# EAGLE design Onion-Omega2-BLE-Pro-Expansion (EAGLE 7.7.0)
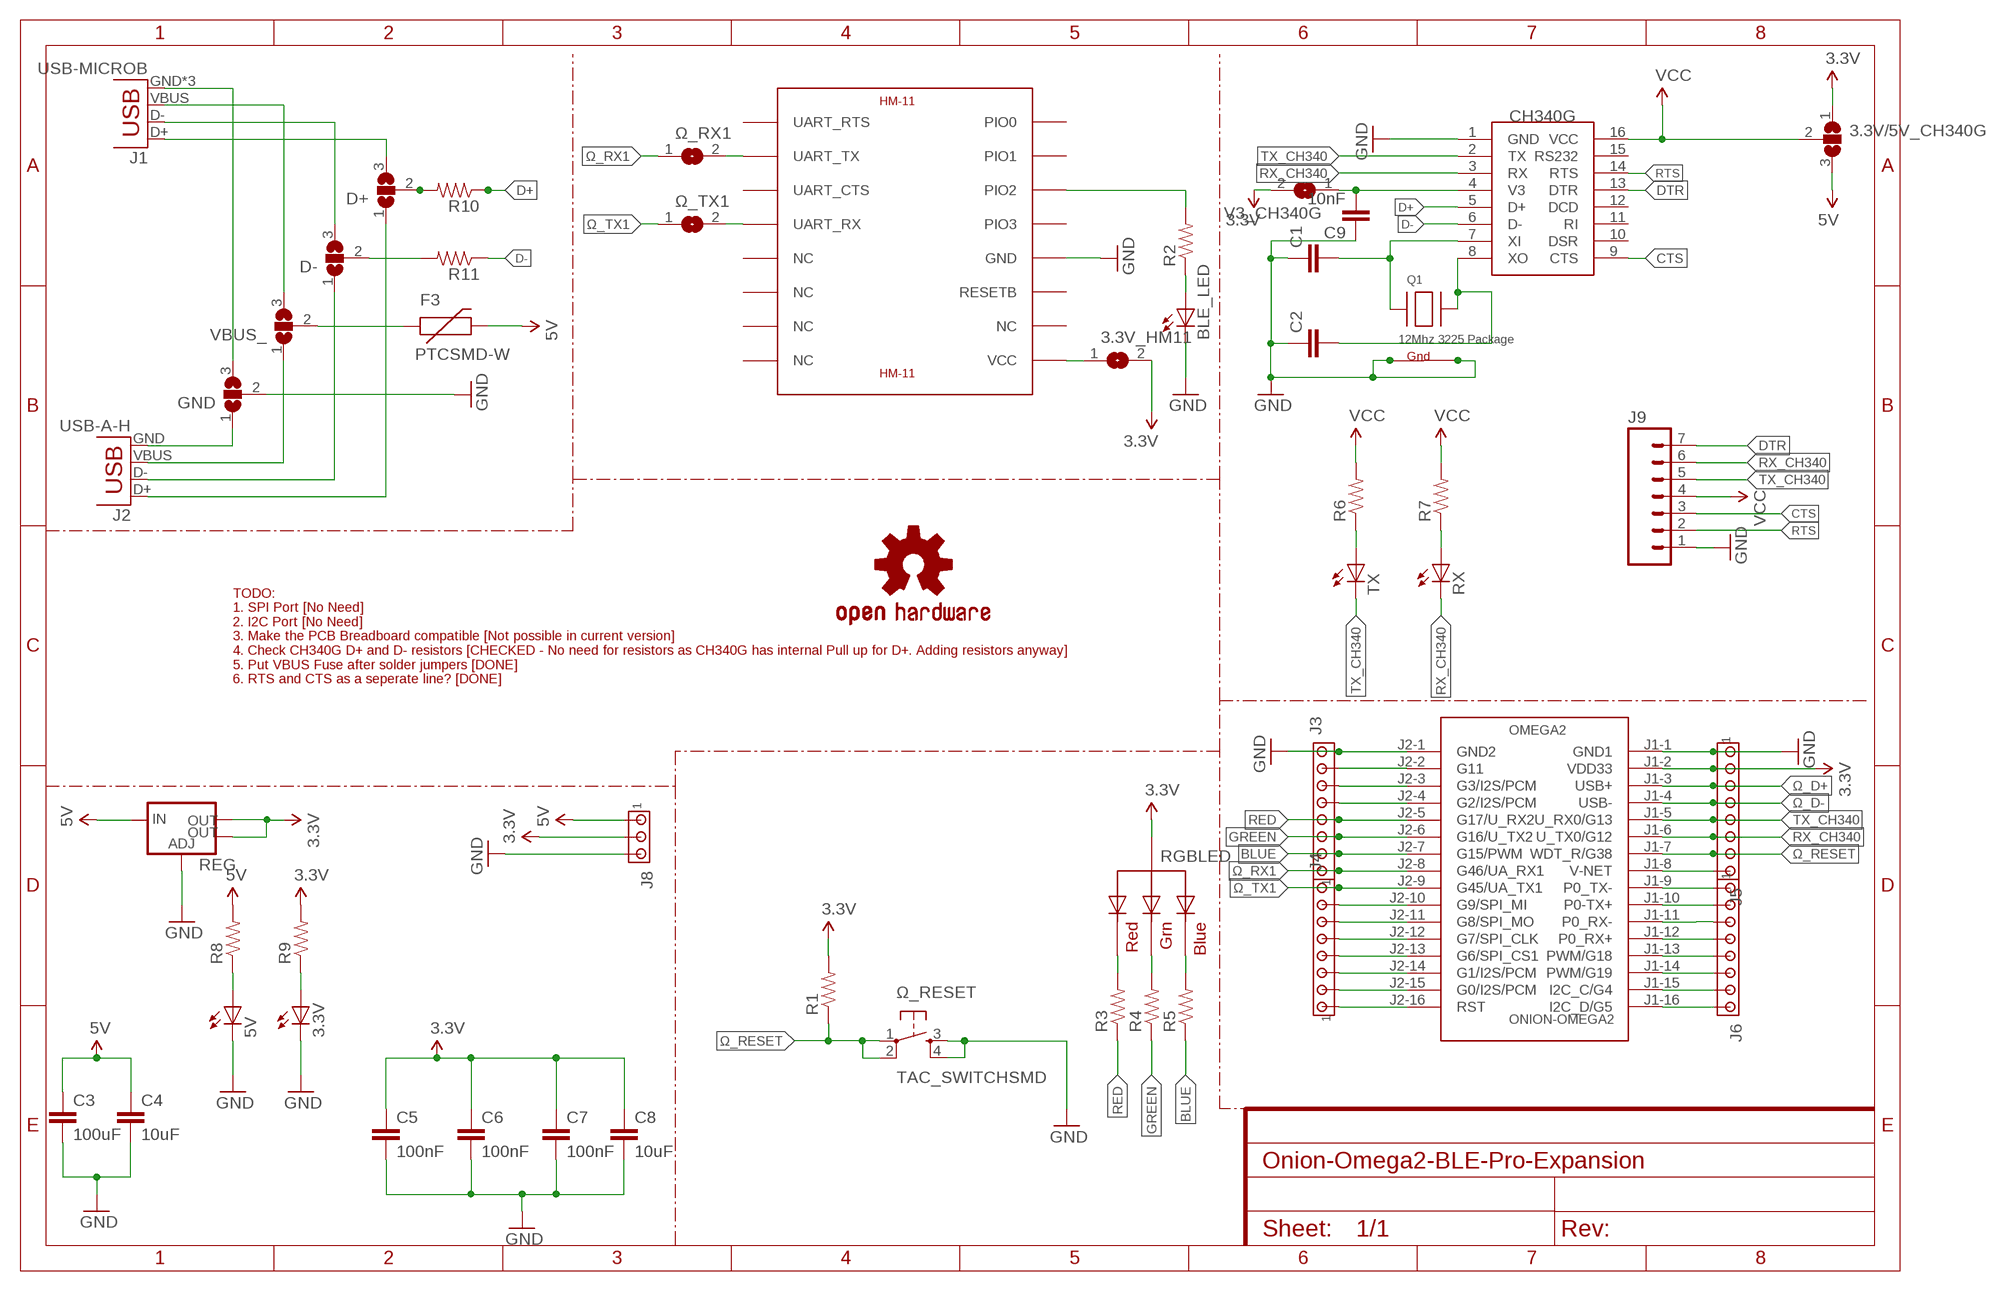
[diagram p0: schematic, sheet 1]

## Parts
3.3V  LEDCHIPLED_1206  [CHIPLED_1206]
3.3V/5V_CH340G  SJ2W  [SJ_2]
3.3V_HM11  SJ  [SJ]
5V  LEDCHIPLED_1206  [CHIPLED_1206]
BLE_LED  LEDCHIPLED_1206  [CHIPLED_1206]
C1  CAP1206  [1206]
C2  CAP1206  [1206]
C3  100uF  CAP1206  [1206]
C4  10uF  CAP1206  [1206]
C5  100nF  CAP1206  [1206]
C6  100nF  CAP1206  [1206]
C7  100nF  CAP1206  [1206]
C8  10uF  CAP1206  [1206]
C9  10nF  CAP1206  [1206]
D+  SJ2W  [SJ_2]
D-  SJ2W  [SJ_2]
F3  PTCSMD-W  [PTC-1206-WIDE]
GND  SJ2W  [SJ_2]
J1  USB-MICROB  [USB-MICROB]
J2  USB-A-H  [USB-A-H]
J3  MTA08-100  [10X08MTA]
J4  MTA08-100  [10X08MTA]
J5  MTA08-100  [10X08MTA]
J6  MTA08-100  [10X08MTA]
J8  MTA03-100  [10X03MTA]
J9  M07SMD  [1X07-SMD-FEMALE-V2]
LOGO1  OSHW-LOGOMINI  [OSHW-LOGO-MINI]
OMEGA2  ONION-OMEGA2  [ONION-2MM-2X16]
Q1  12Mhz 3225 Package  XTAL-4-3225  [NX3225]
R1  RESISTOR1206  [1206]
R2  RESISTOR1206  [1206]
R3  RESISTOR1206  [1206]
R4  RESISTOR1206  [1206]
R5  RESISTOR1206  [1206]
R6  RESISTOR1206  [1206]
R7  RESISTOR1206  [1206]
R8  RESISTOR1206  [1206]
R9  RESISTOR1206  [1206]
R10  RESISTOR0805-RES  [0805]
R11  RESISTOR0805-RES  [0805]
REG  V_REG_LM1117SOT223  [SOT223]
RGBLED  RGBLED_CA-PIRANHA  [PIRANHA5MM]
RX  LEDCHIPLED_1206  [CHIPLED_1206]
TX  LEDCHIPLED_1206  [CHIPLED_1206]
U$1  CH340G  [SOIC16]
U$2  HM-11  [HM-11]
V3_CH340G  SJ  [SJ]
VBUS_  SJ2W  [SJ_2]
Ω_RESET  TAC_SWITCHSMD  [TACTILE-SWITCH-SMD]
Ω_RX1  SJ  [SJ]
Ω_TX1  SJ  [SJ]

## Nets
3.3V: 3.3V/5V_CH340G.1 3.3V_HM11.2 C5.1 C6.1 C7.1 C8.1 J5.2 J8.2 OMEGA2.J1-2(VDD33) R1.2 R9.2 REG.2(OUT) REG.4(OUT) RGBLED.4(VCC) V3_CH340G.2
5V: 3.3V/5V_CH340G.3 C3.1 C4.1 F3.2 J8.1 R8.2 REG.3(IN)
BLUE: J3.2 OMEGA2.J2-7(G15/PWM) R5.1
CTS: J9.3 U$1.9(CTS)
D+: R10.1 U$1.5(D+)
D-: R11.1 U$1.6(D-)
DTR: J9.7 U$1.13(DTR)
GND: 3.3V.C 5V.C BLE_LED.C C1.1 C2.1 C3.2 C4.2 C5.2 C6.2 C7.2 C8.2 C9.1 GND.2 J3.8 J5.1 J8.3 J9.1 OMEGA2.J1-1(GND1) OMEGA2.J2-1(GND2) Q1.2(G2) Q1.4(G1) REG.1(ADJ) U$1.1(GND) U$2.GND Ω_RESET.3 Ω_RESET.4
GREEN: J3.3 OMEGA2.J2-6(G16/U_TX2) R4.1
N$1: C1.2 Q1.1(X1) U$1.7(XI)
N$2: C2.2 Q1.3(X2) U$1.8(XO)
N$3: R2.2 U$2.PIO2
N$4: BLE_LED.A R2.1
N$5: U$2.UART_TX Ω_RX1.2
N$6: J3.7 OMEGA2.J2-2(G11)
N$7: J3.6 OMEGA2.J2-3(G3/I2S/PCM)
N$8: J3.5 OMEGA2.J2-4(G2/I2S/PCM)
N$9: C9.2 U$1.4(V3) V3_CH340G.1
N$11: R6.1 TX.A
N$12: U$2.UART_RX Ω_TX1.2
N$13: 3.3V_HM11.1 U$2.VCC
N$14: J4.7 OMEGA2.J2-10(G9/SPI_MI)
N$15: J4.6 OMEGA2.J2-11(G8/SPI_MO)
N$16: J4.5 OMEGA2.J2-12(G7/SPI_CLK)
N$17: J4.4 OMEGA2.J2-13(G6/SPI_CS1)
N$18: J4.3 OMEGA2.J2-14(G1/I2S/PCM)
N$19: J4.2 OMEGA2.J2-15(G0/I2S/PCM)
N$20: J4.1 OMEGA2.J2-16(RST)
N$21: R3.2 RGBLED.2(RED)
N$22: R4.2 RGBLED.3(GREEN)
N$23: R5.2 RGBLED.1(BLUE)
N$24: R7.1 RX.A
N$25: 5V.A R8.1
N$26: 3.3V.A R9.1
N$27: F3.1 VBUS_.2
N$28: J5.8 OMEGA2.J1-8(V-NET)
N$29: J6.1 OMEGA2.J1-9(P0_TX-)
N$30: J6.2 OMEGA2.J1-10(P0-TX+)
N$31: J6.3 OMEGA2.J1-11(P0_RX-)
N$32: J6.4 OMEGA2.J1-12(P0_RX+)
N$33: J6.5 OMEGA2.J1-13(PWM/G18)
N$34: J6.6 OMEGA2.J1-14(PWM/G19)
N$35: J6.7 OMEGA2.J1-15(I2C_C/G4)
N$36: J6.8 OMEGA2.J1-16(I2C_D/G5)
N$37: J2.VBUS VBUS_.1
N$38: D+.2 R10.2
N$39: GND.1 J2.GND
N$40: GND.3 J1.GND J1.MT1(GND) J1.MT2(GND)
N$41: J1.VBUS VBUS_.3
N$42: D-.3 J1.D-
N$43: D+.3 J1.D+
N$44: D-.2 R11.2
N$45: D-.1 J2.D-
N$46: D+.1 J2.D+
RED: J3.4 OMEGA2.J2-5(G17/U_RX2) R3.1
RTS: J9.2 U$1.14(RTS)
RX_CH340: J5.6 J9.6 OMEGA2.J1-6(U_TX0/G12) RX.C U$1.3(RX)
TX_CH340: J5.5 J9.5 OMEGA2.J1-5(U_RX0/G13) TX.C U$1.2(TX)
VCC: 3.3V/5V_CH340G.2 J9.4 R6.2 R7.2 U$1.16(VCC)
Ω_D+: J5.3 OMEGA2.J1-3(USB+)
Ω_D-: J5.4 OMEGA2.J1-4(USB-)
Ω_RESET: J5.7 OMEGA2.J1-7(WDT_R/G38) R1.1 Ω_RESET.1 Ω_RESET.2
Ω_RX1: J3.1 OMEGA2.J2-8(G46/UA_RX1) Ω_RX1.1
Ω_TX1: J4.8 OMEGA2.J2-9(G45/UA_TX1) Ω_TX1.1
Unconnected: U$1.10(DSR) U$1.11(RI) U$1.12(DCD) U$1.15(RS232) U$2.NC@5(NC) U$2.NC@6(NC) U$2.NC@7(NC) U$2.NC@8(NC) U$2.NC@10(NC) U$2.PIO0 U$2.PIO1 U$2.PIO3 U$2.RESETB U$2.UART_CTS U$2.UART_RTS

## Notes on the sheet
- TODO:
  1. SPI Port [No Need]
  2. I2C Port [No Need]
  3. Make the PCB Breadboard compatible [Not possible in current version]
  4. Check CH340G D+ and D- resistors [CHECKED - No need for resistors as CH340G has internal Pull up for D+. Adding resistors anyway]
  5. Put VBUS Fuse after solder jumpers [DONE]
  6. RTS and CTS as a seperate line? [DONE]

## Library data of the parts
3.3V 5V BLE_LED RX TX = adafruit:LED: LED OSRAM: - CHIPLED LG R971, LG N971, LY N971, LG Q971, LY Q971, LO R971, LY R971 LH N974, LH R974 LS Q976, LO Q976, LY Q976 LO Q996 - Hyper CHIPLED LW Q18S LB Q993, LB Q99A, LB R99A - SideLED LS A670, LO A670, LY A670, LG A670, LP A670 LB A673, LV A673, LT A673, LW A673 LH A674 LY A675 LS A676, LA A676, LO A676, LY A676, LW A676 LS A679, LY A679, LG A679 - Hyper Micro SIDELED® LS Y876, LA Y876, LO Y876, LY Y876 LT Y87S - SmartLED LW L88C, LW L88S LB L89C, LB L89S, LG L890 LS L89K, LO L89K, LY L89K LS L896, LA L896, LO L896, LY L896 - TOPLED LS T670, LO T670, LY T670, LG T670, LP T670 LSG T670, LSP T670, LSY T670, LOP T670, LYG T670 LG T671, LOG T671, LSG T671 LB T673, LV T673, LT T673, LW T673 LH T674 LS T676, LA T676, LO T676, LY T676, LB T676, LH T676, LSB T676, LW T676 LB T67C, LV T67C, LT T67C, LS T67K, LO T67K, LY T67K, LW E67C LS E67B, LA E67B, LO E67B, LY E67B, LB E67C, LV E67C, LT E67C LW T67C LS T679, LY T679, LG T679 LS T770, LO T770, LY T770, LG T770, LP T770 LB T773, LV T773, LT T773, LW T773 LH T774 LS E675, LA E675, LY E675, LS T675 LS T776, LA T776, LO T776, LY T776, LB T776 LHGB T686 LT T68C, LB T68C - Hyper Mini TOPLED® LB M676 - Mini TOPLED Santana® LG M470 LS M47K, LO M47K, LY M47K Source: http://www.osram.convergy.de/
3.3V/5V_CH340G D+ D- GND VBUS_ = jumper:SJ2W: SMD solder JUMPER
3.3V_HM11 V3_CH340G Ω_RX1 Ω_TX1 = jumper:SJ: SMD solder JUMPER
C1-C9 = SparkFun-Passives:CAP: Capacitor Standard 0603 ceramic capacitor, and 0.1" leaded capacitor.
F3 = SparkFun-PowerIC:PTC: Resettable Fuse PTC Resettable Fuse. Spark Fun Electronics SKU : COM-08357
J1 = SparkFun-Connectors:USB: USB Connectors USB-B-PTH is fully proven SKU : PRT-00139/CONN-08278 USB-miniB is fully proven SKU : PRT-00587 USB-A-PCB is untested. USB-A-H is throughly reviewed, but untested. Spark Fun Electronics SKU : PRT-00437 USB-B-SMT is throughly reviewed, but untested. Needs silkscreen touching up. USB-A-S has not been used/tested USB-MB-H has not been used/tested USB-MICROB has been used. CONN-09505; PROD_ID: CONN-09505
J2 = SparkFun-Connectors:USB: USB Connectors USB-B-PTH is fully proven SKU : PRT-00139/CONN-08278 USB-miniB is fully proven SKU : PRT-00587 USB-A-PCB is untested. USB-A-H is throughly reviewed, but untested. Spark Fun Electronics SKU : PRT-00437 USB-B-SMT is throughly reviewed, but untested. Needs silkscreen touching up. USB-A-S has not been used/tested USB-MB-H has not been used/tested USB-MICROB has been used. CONN-09505; PROD_ID: CONN-08367
J3-J6 = con-amp:MTA08-100: AMP connector
J8 = con-amp:MTA03-100: AMP connector
J9 = SparkFun-Connectors:M07: Header 7 Standard 7-pin 0.1" header. Use with straight break away headers (SKU : PRT-00116), right angle break away headers (PRT-00553), swiss pins (PRT-00743), machine pins (PRT-00117), and female headers (PRT-00115). NOTES ON THE VARIANTS LOCK and LOCK_LONGPADS... This footprint was designed to help hold the alignment of a through-hole component (i.e. 7-pin header) while soldering it into place. You may notice that each hole has been shifted either up or down by 0.005 of an inch from it's more standard position (which is usually a perfectly straight line). This slight alteration caused the pins (the squares in the middle) to touch the edges of the holes. Because they are alternating, it causes a "brace" to hold the header in place. 0.005 has proven to be the perfect amount of "off-center" position when using our standard breakaway headers. Although looks a little odd when you look at the bare footprint, once you have a header in there, the alteration is very hard to notice. Also, if you push a header all the way into place, it is covered up entirely on the bottom side. This idea of altering the position of holes to aid alignment will be further integrated into the Sparkfun Library for other footprints. It can help hold any component with 3 or more connection pins.
LOGO1 = SparkFun-Aesthetics:OSHW-LOGO: Open Source Hardware Logo This logo indicates the piece of hardware it is found on incorporates a OSHW license and/or adheres to the definition of open source hardware found here: http://freedomdefined.org/OSHW
OMEGA2 = Onion2:ONION-OMEGA2: Onion Omega
Q1 = adafruit:XTAL-4: Classic 4-pin 3.2 x 2.5mm crystal
R1-R11 = SparkFun-Passives:RESISTOR: Resistor Basic schematic elements and footprints for 0603, 1206, and PTH resistors.
REG = SparkFun-PowerIC:V_REG_LM1117: Voltage Regulator LM1117 Standard adjustable voltage regulator but in SMD form. Spark Fun Electronics SKU : COM-00595; PROD_ID: VREG-08170
RGBLED = adafruit:RGBLED_CA: RGB LED, common-anode 5MM Staggered pins 5mm Piranha package http://www.ladyada.net/library/pcb/eaglelibrary.html
U$1 = ch340g:CH340G
U$2 = hm-11:HM-11: JNHuaMao HM-11 Bluetooth 4.0 Transceiver based on TI CC2540/CC2541
Ω_RESET = SparkFun-Retired:TAC_SWITCH: Momentary Switch Button commonly used for reset or general input. Spark Fun Electronics SKU : COM-00097 SMT- SWCH-08247; PROD_ID: SWCH-08247

## Board
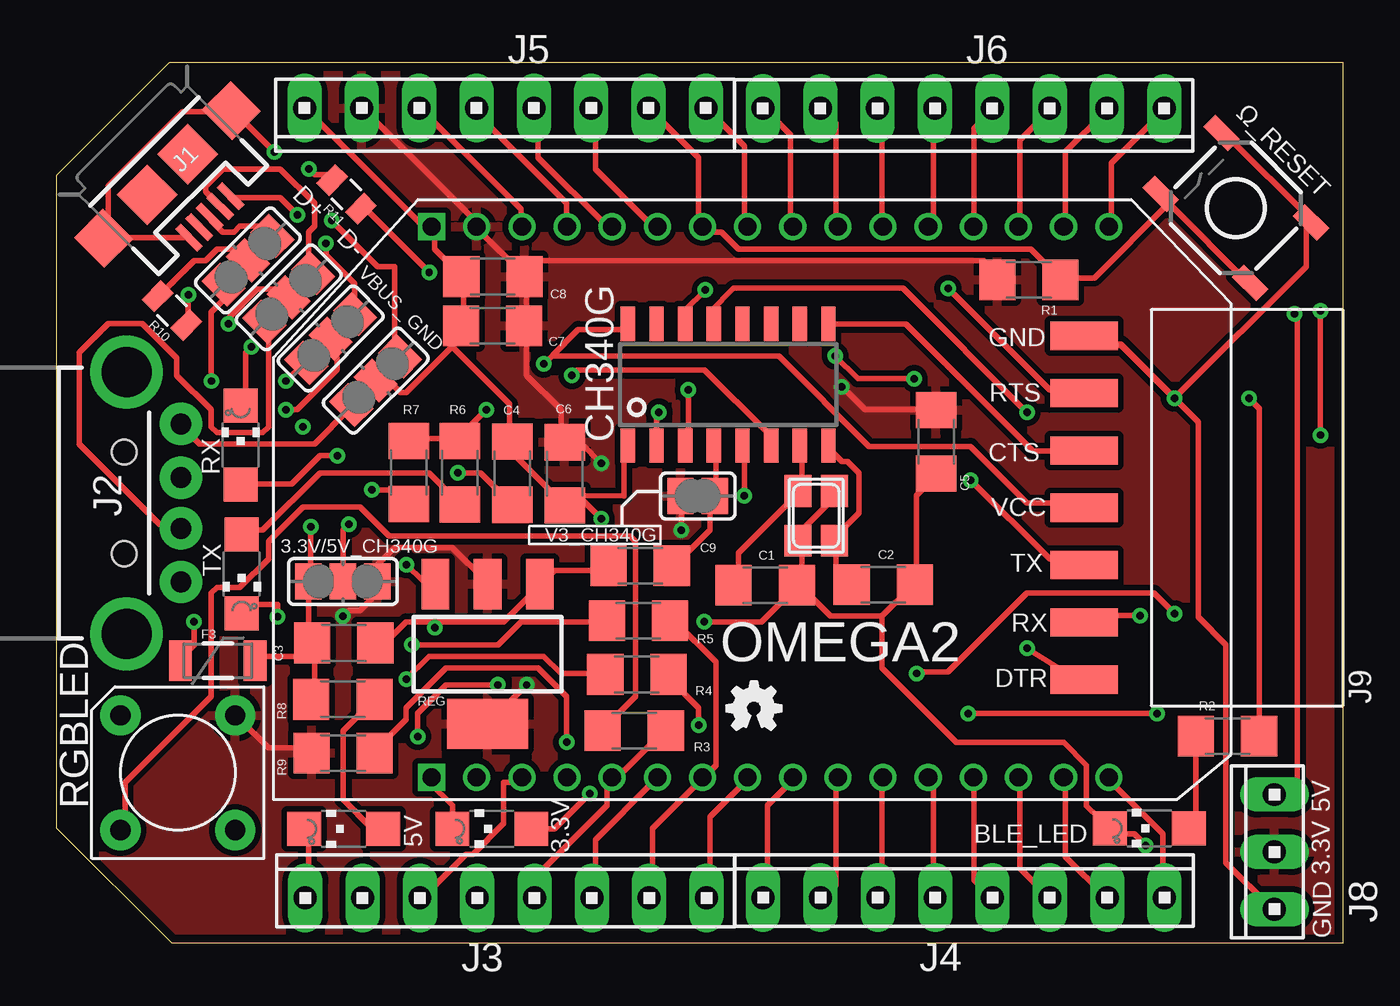
[diagram p1: board, top side]
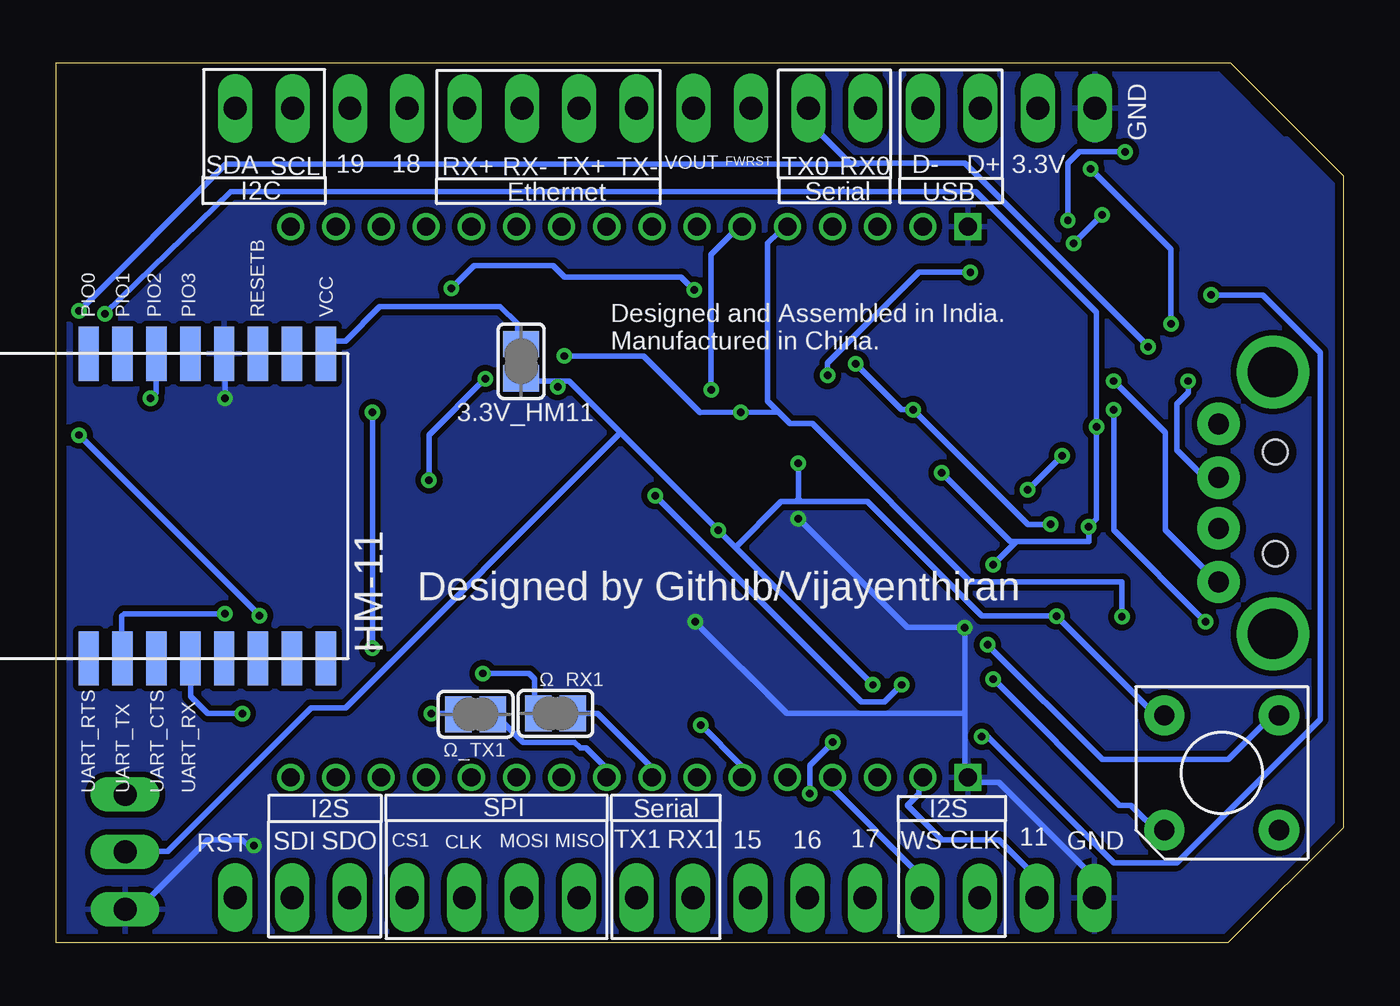
[diagram p2: board, bottom side, seen from below]

Size 57 x 39 mm. Coordinates in mm from the lower left corner, seen from the top.
Outline: 57,39 5,39 0,34 0,5.1 5.1,0 57,0 57,39
Copper layers (1*16): Top 0.0356mm / dielectric 1.5011mm / Bottom 0.0356mm
Design rules "LaenPCBOrder *": minimum track width 10mil, minimum drill 13mil, track to track 10mil, track to pad 10mil, pad to pad 10mil, via to via 10mil, smd to smd 10mil, copper to edge 15mil, drill to drill 6mil, minimum pad ring 7mil, minimum via ring 7mil, stop-mask expansion 3mil, vias tented up to drill 0mil, thermal gap 10mil

### Footprints (pad centres in the part's own frame; a part is rotated, then mirrored left to right if it is on the bottom)
CHIPLED_1206 = smd 1.5 x 1.5: A 0,-1.75; C 0,1.75
SJ_2 = smd 1.168 x 1.6: 1 -1.524,0; 2 0,0; 3 1.524,0
SJ = smd 1.168 x 1.6: 1 -0.762,0; 2 0.762,0
1206 = smd 1.6 x 1.8: 1 -1.4,0; 2 1.4,0
PTC-1206-WIDE = smd 1 x 1.8: 1 -1.654,0; 2 1.654,0
USB-MICROB = smd 0.35 x 1.4: D+ 0,2.65; D- -0.65,2.65; GND 1.3,2.65; ID 0.65,2.65; VBUS -1.3,2.65 | smd 1.8 x 1.9: MT1 -4,0; MT2 4,0 | smd 1.9 x 1.9: P$1 -1.27,0; P$2 1.27,0
USB-A-H = drill 0.914 pad 1.88: D+ 2.4,1.127; D- 2.4,-1.127; GND 2.4,3.5; VBUS 2.4,-3.5 | drill 2.2: GND2 0,-5.8; GND3 0,5.8 | hole 1.1: -0.1,2.25; -0.1,-2.25
10X08MTA = drill 1.016 long: 1 8.89,0; 2 6.35,0; 3 3.81,0; 4 1.27,0; 5 -1.27,0; 6 -3.81,0; 7 -6.35,0; 8 -8.89,0
10X03MTA = drill 1.016 long: 1 2.54,0; 2 0,0; 3 -2.54,0
1X07-SMD-FEMALE-V2 = smd 1.25 x 3: 1 6.35,3.425; 2 3.81,3.425; 3 1.27,3.425; 4 -1.27,3.425; 5 -3.81,3.425; 6 -6.35,3.425; 7 -8.89,3.425
ONION-2MM-2X16 = drill 0.8 square: J1-1 12.4,14; J2-1 -12,14 | drill 0.8: J1-2 12.4,12; J1-3 12.4,10; J1-4 12.4,8; J1-5 12.4,6; J1-6 12.4,4; J1-7 12.4,2; J1-8 12.4,0; J1-9 12.4,-2; J1-10 12.4,-4; J1-11 12.4,-6; J1-12 12.4,-8; J1-13 12.4,-10; J1-14 12.4,-12; J1-15 12.4,-14; J1-16 12.4,-16; J2-2 -12,12; J2-3 -12,10; J2-4 -12,8; J2-5 -12,6; J2-6 -12,4; J2-7 -12,2; J2-8 -12,0; J2-9 -12,-2; J2-10 -12,-4; J2-11 -12,-6; J2-12 -12,-8; J2-13 -12,-10; J2-14 -12,-12; J2-15 -12,-14; J2-16 -12,-16
NX3225 = smd 1.4 x 1.2: 1 -1.1,-0.8; 2 1.1,-0.8; 3 1.1,0.8; 4 -1.1,0.8
0805 = smd 0.8 x 1.2: 1 -0.9,0; 2 0.9,0
SOT223 = smd 1.219 x 2.235: 1 -2.311,-3.099; 2 0,-3.099; 3 2.311,-3.099 | smd 3.6 x 2.2: 4 0,3.099
PIRANHA5MM = drill 0.9 pad 1.778: 1 -2.54,2.54; 2 -2.54,-2.54; 3 2.54,-2.54; 4 2.54,2.54
SOIC16 = smd 0.635 x 1.524: 1 -4.445,-2.695; 2 -3.175,-2.695; 3 -1.905,-2.695; 4 -0.635,-2.695; 5 0.635,-2.695; 6 1.905,-2.695; 7 3.175,-2.695; 8 4.445,-2.695; 9 4.445,2.695; 10 3.175,2.695; 11 1.905,2.695; 12 0.635,2.695; 13 -0.635,2.695; 14 -1.905,2.695; 15 -3.175,2.695; 16 -4.445,2.695
HM-11 = smd 2.4 x 0.9: GND 6.5,0; NC@5 -7,0; NC@6 -7,-1.5; NC@7 -7,-3; NC@8 -7,-4.5; NC@10 6.5,-3; PIO0 6.5,6; PIO1 6.5,4.5; PIO2 6.5,3; PIO3 6.5,1.5; RESETB 6.5,-1.5; UART_CTS -7,3; UART_RTS -7,6; UART_RX -7,1.5; UART_TX -7,4.5; VCC 6.5,-4.5
TACTILE-SWITCH-SMD = smd 1.524 x 0.762: 1 -2.794,1.905; 2 2.794,1.905; 3 -2.794,-1.905; 4 2.794,-1.905

### Placement (x,y rotation side)
3.3V  19.29,5.06 90 top
3.3V/5V_CH340G  12.69,16.01 180 top
3.3V_HM11  36.41,25.77 270 bottom
5V  12.73,5.05 90 top
BLE_LED  48.41,5.08 90 top
C1  31.4,15.85 180 top
C2  36.63,15.87 180 top
C3  12.73,13.29 0 top
C4  20.2,20.81 90 top
C5  38.97,22.2 270 top
C6  22.52,20.78 270 top
C7  19.32,27.34 180 top
C8  19.34,29.52 180 top
C9  25.86,16.71 0 top
D+  8.49,30.24 45 top
D-  10.29,28.6 45 top
F3  7.15,12.5 0 top
GND  14.15,24.91 45 top
J1  4.92,34.05 225 top
J2  3.11,19.49 0 top
J3  19.91,1.99 0 top
J4  40.2,2 0 top
J5  19.88,36.99 180 top
J6  40.19,36.98 180 top
J8  53.96,4.03 90 top
J9  48.95,20.55 90 top
LOGO1  30.9,10.4 0 top
OMEGA2  30.62,19.34 90 top
Q1  33.66,18.92 270 top
R1  43.08,29.38 180 top
R2  51.88,9.15 0 top
R3  25.59,9.4 180 top
R4  25.71,11.89 180 top
R5  25.79,14.27 180 top
R6  17.87,20.83 90 top
R7  15.62,20.84 90 top
R8  12.69,10.79 180 top
R9  12.7,8.41 180 top
R10  5.12,28.01 135 top
R11  12.85,33.16 135 top
REG  19.1,12.8 180 top
RGBLED  5.38,7.54 0 top
RX  8.16,22.06 0 top
TX  8.21,16.34 180 top
U$1  29.76,24.73 0 top
U$2  49.57,19.6 90 bottom
V3_CH340G  28.41,19.8 180 top
VBUS_  12.15,26.78 45 top
Ω_RESET  52.25,32.56 135 top
Ω_RX1  34.89,10.17 180 bottom
Ω_TX1  38.43,10.13 180 bottom

### Tracks (layer width: path | path; a pad name or v marks a point on that pad's centre or on a via)
3.3V  (via drill 0.33)
  Top 0.254: C8.1 20.83,29.46 20.83,27.43 C7.1 20.83,27.18 20.83,25.15 22.35,23.62 22.35,22.35 C6.1 22.61,22.1 23.28,22.1 v24.13,21.25 | 41.66,29.46 R1.2 41.09,30.22 20.78,30.22 C8.1 | C8.1 20.57,29.72 18.8,31.5 OMEGA2.J1-2 18.8,31.75 13.72,36.83 J5.2 | REG.2 19.05,16 17.53,17.53 14.99,17.53 14.22,16.76 14.22,16.26 3.3V/5V_CH340G.1 13.97,16 13.97,15.24 13.46,14.73 12.95,14.73 v12.7,14.48 | R9.2 11.18,8.64 9.4,8.64 8.13,9.91 RGBLED.4 | v27.69,18.29 27.69,19.56 V3_CH340G.2 | v34.8,24.64 35.81,23.62 38.86,23.62 C5.1 | v20.83,11.43 19.3,9.91 REG.4
  Bottom 0.254: RGBLED.4 8.13,9.91 v12.7,14.48 16,14.48 21.08,19.56 24.13,19.56 | 32,22.61 34.29,24.89 34.8,24.89 | 32,22.61 v27.69,18.29 26.92,17.53 | 34.8,24.89 36.32,24.89 3.3V_HM11.2 | 34.8,24.89 v34.8,24.64 | 32,22.61 44.2,10.41 45.72,10.41 52.07,4.06 53.85,4.06 J8.2 | 26.92,17.53 v20.83,11.43 | 24.24,19.56 24.13,19.56 | 26.92,17.53 24.89,19.56 24.24,19.56 | 24.13,19.56 v24.13,21.25 | 24.24,19.56 24.15,19.65 24.1,19.65 24.05,19.6 24.15,19.6
  pour Top: 0.4,29.3 0.4,33.25 5.75,38.6 56.5,38.6 56.5,0.4 5.45,0.4 0.4,5.45 0.4,29.2 0.35,29.25
5V  (via drill 0.33)
  Top 0.254: C3.1 11.18,13.46 3.3V/5V_CH340G.3 10.92,16.26 11.27,16.26 v11.27,18.43 | 11.43,12.7 11.43,13.21 C3.1 | 11.43,12.7 11.43,10.92 R8.2 | v17.78,20.83 18.8,20.83 20.07,19.56 C4.1 | v15.49,16.76 16.26,16 16.76,16 REG.3 | 54.1,6.6 J8.1 54.97,6.57 54.97,27.76 v54.85,27.88 | 11.43,12.7 8.89,12.7 F3.2 | 11.43,12.7 C3.1
  Bottom 0.254: v17.78,20.83 14.73,17.78 14.48,17.78 | 14.48,17.78 v15.49,16.76 | v54.85,27.88 49.28,33.27 16.26,33.27 10.92,27.94 v10.92,22.86 10.92,18.78 v11.27,18.43 11.27,17.78 14.48,17.78
BLUE
  Top 0.254: R5.1 27.43,14.22 29.21,12.45 29.21,7.87 28.7,7.37 OMEGA2.J2-7 28.45,7.11 26.42,5.08 26.42,2.03 J3.2
CTS
  Top 0.254: U$1.9 37.62,27.43 43.25,21.8 45.51,21.8 J9.3
D+  (via drill 0.33)
  Top 0.254: v5.84,28.7 5.84,27.43 R10.1 | v16,9.14 16,10.16 17.27,11.43 v19.56,11.43 | v30.48,19.81 30.48,21.84 U$1.5
  Bottom 0.254: v5.84,28.7 3.56,28.7 1.02,26.16 1.02,9.91 7.37,3.56 10.16,3.56 15.75,9.14 v16,9.14 | v19.56,11.43 20.32,10.67 21.34,10.67 v30.48,19.81
D-  (via drill 0.33)
  Top 0.254: U$1.6 31.5,22.1 31.5,22.61 28.7,25.38 23.07,25.38 v22.83,25.14 | v16.51,29.72 13.72,32.51 R11.1
  Bottom 0.254: v16.51,29.72 18.8,29.72 22.83,25.68 v22.83,25.14
DTR  (via drill 0.33)
  Top 0.254: v43,23.5 37.5,29 30,29 29,28 29,27.5 U$1.13 | v43,13.05 45.5,11.5 J9.7
  Bottom 0.254: v43,13.05 v43,23.5
GND  (via drill 0.33)
  Top 0.254: OMEGA2.J2-1 16.51,7.11 17.54,6.08 3.3V.C | 5V.C 11.18,4.83 11.18,2.03 J3.8 | 16.76,14.22 19.81,14.22 21.34,15.75 REG.1 21.59,16 22.1,16.51 24.38,16.51 C9.1 | 16.76,14.22 15.49,14.22 14.73,13.46 14.22,13.46 C3.2 | 16.76,14.22 v16.76,13.97 | 23.11,19.81 22.61,19.3 C6.2 | 23.11,19.81 25.15,19.8 25.15,21.84 U$1.1 | C6.2 22.35,19.56 20.32,21.59 20.32,22.1 C4.2 20.07,22.35 20.07,23.88 17.53,26.42 | 17.53,26.42 17.78,26.67 17.78,27.18 C7.2 18.03,27.43 18.03,29.46 C8.2 17.78,29.72 16.76,30.73 16.76,31.5 OMEGA2.J1-1 16.51,31.5 11.18,36.83 J5.1 | 17.53,26.42 15.49,24.38 15.24,24.38 14.73,24.89 14.22,24.89 GND.2 | 23.11,19.81 v24.13,18.8 | 23.11,19.81 C6.2 | Ω_RESET.4 51.82,35.81 55.63,32 Ω_RESET.3 55.37,31.75 55.37,29.97 v49.53,24.13 50.58,23.08 50.58,14.44 51.82,13.2 51.82,3.56 53.85,1.52 J8.3 | C1.1 33.02,16 33.02,17.78 Q1.2 32.77,18.03 34.29,19.56 34.29,19.81 Q1.4 | C5.2 38.86,20.57 38.1,19.81 38.1,16 C2.1 37.85,15.75 36.58,14.48 | 36.58,14.48 34.29,14.48 33.02,15.75 C1.1 | v48.26,4.32 47.75,4.83 46.74,4.83 BLE_LED.C 45.63,6.08 45.63,7.87 44.64,8.89 39.88,8.89 36.58,12.19 36.58,14.48 | v28.7,14.22 31.24,14.22 32.77,15.75 C1.1 | 46,26.5 J9.1
  Top 0.305: 46,26.5 47.16,26.5 v49.53,24.13
  Bottom 0.254: J3.8 11.18,2.03 11.18,3.05 15.24,7.11 16.51,7.11 OMEGA2.J2-1 16.76,7.37 16.76,10.16 | 16.76,10.16 v16.76,13.97 19.3,13.97 v24.13,18.8 | v49.53,24.13 49.53,25.91 U$2.GND | v48.26,4.32 48.51,4.32 48.77,4.57 50.29,4.57 53.34,1.52 53.85,1.52 J8.3 | 16.76,10.16 24.64,10.16 v28.7,14.22
  pour Bottom: 2.72,35.64 5.69,38.61 56.43,38.58 56.43,0.27 5.55,0.3 0.38,5.47 0.38,33.5 2.49,35.61 2.73,35.61
GREEN  (via drill 0.33)
  Top 0.254: v28.45,9.65 28.45,10.41 27.18,11.68 R4.1 | J3.3 23.88,2.03 23.88,4.57 26.42,7.11 OMEGA2.J2-6
  Bottom 0.254: v28.45,9.65 26.67,7.87 26.67,7.37 OMEGA2.J2-6
N$1
  Top 0.254: U$1.7 33.02,21.84 33.02,20.07 Q1.1 32.77,19.81 30.23,17.27 30.23,16 C1.2
N$2
  Top 0.254: C2.2 35.05,16 34.54,16.51 34.54,17.78 Q1.3 34.54,18.03 35.56,19.05 35.56,20.83 35.05,21.34 34.8,21.34 34.29,21.84 U$1.8
N$3  (via drill 0.33)
  Top 0.254: 53.09,23.88 v52.83,24.13 53.28,23.68 R2.2
  Bottom 0.254: v52.83,24.13 52.58,24.38 52.58,25.91 U$2.PIO2
N$4
  Top 0.254: BLE_LED.A 50.29,5.08 50.48,5.27 R2.1
N$5  (via drill 0.33)
  Top 0.254: v38.1,11.94 38,12 39.5,12 43,15.5 48.62,15.5 v49.54,14.58
  Bottom 0.254: v38.1,11.94 36.07,11.94 35.81,11.68 35.81,10.41 Ω_RX1.2 | U$2.UART_TX 54.1,12.7 54.1,14.48 54,14.58 v49.54,14.58
N$6
  Bottom 0.254: OMEGA2.J2-2 18.8,7.11 18.8,6.6 19.3,6.1 17.78,4.57 15.24,4.57 13.72,3.05 13.72,2.03 J3.7
N$7
  Top 0.254: OMEGA2.J2-3 20.57,7.11 19.81,7.11 19.81,5.29 18.45,3.93 18.15,3.93 16.26,2.03 J3.6
N$8
  Bottom 0.254: OMEGA2.J2-4 22.61,7.11 22.61,6.86 18.8,3.05 18.8,2.03 J3.5
N$9
  Top 0.254: U$1.4 29.21,21.84 29.21,19.81 V3_CH340G.1 28.96,19.56 28.96,18.29 27.43,16.76 C9.2
N$11
  Top 0.254: TX.A 8.38,18.29 9.14,18.29 11.68,20.83 16.51,20.83 17.78,19.56 R6.1
N$12  (via drill 0.33)
  Top 0.254: v48.77,10.16 v40.39,10.16
  Bottom 0.254: v40.39,10.16 39.37,10.16 Ω_TX1.2 | v48.77,10.16 50.29,10.16 51.05,10.92 51.05,12.45 U$2.UART_RX
N$13
  Bottom 0.254: 3.3V_HM11.1 36.58,26.67 36.58,27.43 37.34,28.19 42.67,28.19 44.2,26.67 44.96,26.67 45.21,26.42 45.21,26.16 U$2.VCC
N$14
  Top 0.254: OMEGA2.J2-10 34.54,7.11 34.54,2.54 34.04,2.03 J4.7
N$15
  Top 0.254: OMEGA2.J2-11 36.58,7.11 36.58,2.03 J4.6
N$16
  Top 0.254: OMEGA2.J2-12 38.86,7.11 38.86,2.03 J4.5
N$17
  Top 0.254: OMEGA2.J2-13 40.64,7.11 40.64,2.79 41.4,2.03 J4.4
N$18
  Top 0.254: OMEGA2.J2-14 42.67,7.11 42.67,3.3 43.94,2.03 J4.3
N$19
  Top 0.254: OMEGA2.J2-15 44.7,7.11 44.7,3.81 46.48,2.03 J4.2
N$20
  Top 0.254: OMEGA2.J2-16 46.74,7.11 49.02,4.83 49.02,2.03 J4.1
N$21
  Top 0.254: R3.2 24.38,9.65 25.65,10.92 25.65,17.78 25.4,18.03 14.73,18.03 13.46,19.3 10.92,19.3 9.4,17.78 9.4,17.02 8.13,15.75 7.11,15.75 6.86,15.49 6.86,10.92 3.05,7.11 3.05,5.08 RGBLED.2
N$22  (via drill 0.33)
  Top 0.254: v15.49,11.68 16.51,12.7 21.59,12.7 22.35,11.94 24.13,11.94 R4.2
  Bottom 0.254: v15.49,11.68 9.91,6.1 9.4,6.1 8.13,4.83 RGBLED.3
N$23  (via drill 0.33)
  Top 0.254: v15.75,13.21 19.56,13.21 20.57,14.22 24.38,14.22 R5.2
  Bottom 0.254: v15.75,13.21 10.67,8.13 5.08,8.13 3.05,10.16 RGBLED.1
N$24  (via drill 0.33)
  Top 0.254: v12.45,21.59 11.68,21.59 10.41,20.32 8.38,20.32 RX.A | v13.97,20.07 14.99,20.07 15.49,19.56 R7.1
  Bottom 0.254: v13.97,20.07 v12.45,21.59
N$25
  Top 0.254: 5V.A 14.48,5.08 13.97,5.08 12.7,6.35 12.7,9.4 13.97,10.67 R8.1
N$26  (via drill 0.33)
  Top 0.254: v22.61,8.89 22.61,10.92 21.34,12.19 17.27,12.19 15.49,10.41 15.49,9.91 14.22,8.64 R9.1 | 3.3V.A 22.08,5.06 v23.62,6.6
  Bottom 0.254: v23.62,6.6 23.62,7.87 v22.61,8.89
N$27  (via drill 0.33)
  Top 0.254: v10.16,23.62 10.67,23.62 12.45,25.4 12.45,25.91 12.19,26.16 12.19,26.67 VBUS_.2 | v6.1,14.22 6.1,13.21 5.59,12.7 F3.1
  Bottom 0.254: v10.16,23.62 10.16,18.29 v6.1,14.22
N$28
  Top 0.254: OMEGA2.J1-8 30.48,31.75 30.48,35.31 28.96,36.83 J5.8
N$29
  Top 0.254: OMEGA2.J1-9 32.51,31.75 32.51,35.81 31.5,36.83 J6.1
N$30
  Top 0.254: OMEGA2.J1-10 34.54,31.75 34.54,36.32 34.04,36.83 J6.2
N$31
  Top 0.254: OMEGA2.J1-11 36.58,31.75 36.58,36.83 J6.3
N$32
  Top 0.254: OMEGA2.J1-12 38.86,31.75 38.86,36.83 J6.4
N$33
  Top 0.254: OMEGA2.J1-13 40.64,31.75 40.64,36.07 41.4,36.83 J6.5
N$34
  Top 0.254: OMEGA2.J1-14 42.67,31.75 42.67,35.56 43.94,36.83 J6.6
N$35
  Top 0.254: OMEGA2.J1-15 44.7,31.75 44.7,35.05 46.48,36.83 J6.7
N$36
  Top 0.254: OMEGA2.J1-16 46.74,31.75 46.74,34.54 49.02,36.83 J6.8
N$37  (via drill 0.33)
  Top 0.254: v10.16,24.89 10.92,25.65 VBUS_.1
  Bottom 0.254: v10.16,24.89 7.87,22.61 7.87,18.29 5.59,16 J2.VBUS
N$38
  Top 0.254: R10.2 4.57,28.7 6.1,30.23 6.6,30.23 7.11,30.73 8.13,30.73 8.38,30.48 D+.2
N$39
  Top 0.254: GND.1 12.95,23.62 11.43,22.1 6.35,22.1 5.59,22.86 J2.GND
N$40  (via drill 0.33)
  Top 0.254: 2.29,31.24 5.84,31.24 J1.GND | GND.3 14.99,26.16 14.99,29.97 14.22,29.97 v12.19,32 | 7.87,37.08 J1.MT1 | 2.29,31.24 2.29,33.53 5.59,36.83 7.62,36.83 J1.MT1 | 2.29,31.24 J1.MT2 | v9.65,35.05 7.87,36.83 J1.MT1
  Bottom 0.254: v12.19,32 12.19,34.54 11.68,35.05 v9.65,35.05
N$41  (via drill 0.33)
  Top 0.254: v10.67,32.26 9.91,33.02 7.87,33.02 J1.VBUS | v11.94,30.99 11.94,30.48 13.21,29.21 13.21,27.94 VBUS_.3
  Bottom 0.254: v11.94,30.99 v10.67,32.26
N$42
  Top 0.254: J1.D- 7.11,32.77 6.6,33.27 6.6,33.53 7.37,34.29 9.91,34.29 11.43,32.77 11.43,31.75 11.18,31.5 11.18,29.72 D-.3
N$43
  Top 0.254: J1.D+ 6.86,32 7.37,31.5 7.87,31.5 8.13,31.75 9.14,31.75 9.4,31.5 D+.3
N$44  (via drill 0.33)
  Top 0.254: v11.18,34.29 11.43,34.04 12.19,34.04 R11.2 | v7.62,27.43 7.62,27.69 8.89,28.96 9.91,28.96 10.16,28.7 D-.2
  Bottom 0.254: v11.18,34.29 7.62,30.73 v7.62,27.43
N$45
  Top 0.254: D-.1 9.4,27.43 9.4,22.86 9.14,22.61 7.11,22.61 6.86,22.86 6.86,23.62 5.33,25.15 5.33,25.91 3.81,27.43 2.29,27.43 1.02,26.16 1.02,22.1 4.57,18.54 5.33,18.54 J2.D-
N$46  (via drill 0.33)
  Top 0.254: v6.86,24.89 6.86,27.94 7.37,28.45 7.37,28.96 D+.1
  Bottom 0.254: v6.86,24.89 6.86,24.38 7.37,23.88 7.37,21.84 6.35,20.83 5.59,20.83 J2.D+
RED
  Top 0.254: R3.1 26.92,9.4 24.64,7.11 OMEGA2.J2-5 24.38,7.11 24.38,6.1 21.34,3.05 21.34,2.03 J3.4
RTS  (via drill 0.33, 0.33 pad 0.25)
  Top 0.254: U$1.14 27.86,28.03 v28.75,28.93 | v39.5,29 44,24.5 45.5,24.5 J9.2
  Bottom 0.254: v39.5,29 38.5,30 35,30 34.5,29.5 29.32,29.5 v28.75,28.93
RX_CH340  (via drill 0.33)
  Top 0.254: v8.64,26.42 8.38,26.16 8.38,23.88 RX.C | J5.6 23.88,36.83 23.88,34.29 26.42,31.75 OMEGA2.J1-6 | v28,24.5 28,22.5 U$1.3 | v48,14.5 46,14.5 J9.6 | v56,28 v56,22.5
  Bottom 0.254: v8.64,26.42 16.76,34.54 21.5,34.54 | 21.5,34.54 21.84,34.54 23.62,36.32 23.62,36.83 J5.6 | v28,24.5 28,30.5 27,31.5 OMEGA2.J1-6 | v56,22.5 v48,14.5 | v56,28 49.5,34.5 21.5,34.5 21.5,34.54
TX_CH340  (via drill 0.33)
  Top 0.254: J5.5 21.34,36.83 21.34,34.8 24.38,31.75 OMEGA2.J1-5 | TX.C 8.5,15 9.8,15 v9.8,14.45 | 26.5,22.5 U$1.2 26.59,23.41 v26.69,23.51 | v40.5,20.5 44,17 45.5,17 J9.5 | v38,25 35.5,25 v34.5,26
  Bottom 0.254: 25,23.5 25.5,24 25.5,31 25,31.5 OMEGA2.J1-5 | 25,23.5 24.5,23 23.5,23 16.5,16 9.8,16 v9.8,14.45 | 25,23.5 v26.69,23.51 28.5,23.5 31,26 v34.5,26 | v40.5,20.5 40.5,22.5 v38,25
VCC  (via drill 0.33)
  Top 0.254: v21.59,25.65 21.97,26.03 | 21.97,26.03 23.11,27.18 25.15,27.18 U$1.16 | 17.78,22.35 v19.05,23.62 | v12.95,18.54 12.7,18.29 12.7,16.26 3.3V/5V_CH340G.2 | 17.78,22.35 15.75,22.35 R7.2 | 17.78,22.35 R6.2 | J9.4 45.5,19.5 43,19.5 40.5,22 36,22 32,26 22,26 21.97,26.03
  Bottom 0.254: v21.59,25.65 19.56,23.62 v19.05,23.62 13.97,18.54 v12.95,18.54
Ω_D+
  Top 0.254: OMEGA2.J1-3 20.57,31.75 20.57,32.51 16.26,36.83 J5.3
Ω_D-
  Top 0.254: OMEGA2.J1-4 22.61,31.75 22.61,32.77 18.54,36.83 J5.4
Ω_RESET
  Top 0.254: J5.7 26.42,36.83 28.45,34.8 28.45,31.75 OMEGA2.J1-7 28.7,31.5 29.46,31.5 30.23,30.73 43.18,30.73 44.45,29.46 R1.1 44.7,29.46 45.97,29.46 49.28,32.77 | 49.28,32.77 52.83,29.21 Ω_RESET.1 | 49.28,32.77 49.02,33.02 Ω_RESET.2 49.28,32.77
Ω_RX1
  Top 0.254: J3.1 28.96,2.03 28.96,5.59 30.48,7.11 OMEGA2.J2-8
  Bottom 0.254: Ω_RX1.1 34.04,10.16 33.02,10.16 30.73,7.87 30.73,7.37 OMEGA2.J2-8
Ω_TX1
  Top 0.254: J4.8 31.5,2.03 31.5,6.1 32.51,7.11 OMEGA2.J2-9
  Bottom 0.254: Ω_TX1.1 37.59,9.91 37.34,9.91 36.32,8.89 34.04,8.89 33.78,8.64 33.53,8.64 32.77,7.87 32.77,7.37 OMEGA2.J2-9

### Text on the board
tNames: GND | RTS | CTS | VCC | TX | RX | DTR | 5V | 3.3V | GND
bNames: GND | 3.3V | D+ | D- | RX0 | TX0 | FWRST | VOUT | TX- | TX+ | RX- | RX+ | 18 | 19 | SCL | SDA | USB | Serial | Ethernet | I2C | Designed and Assembled in India. / Manufactured in China. | Designed by Github/Vijayenthiran | I2S | Serial | SPI | I2S | GND | 11 | CLK | WS | 17 | 16 | 15 | RX1 | TX1 | MISO | MOSI | CLK | CS1 | SDO | SDI | RST